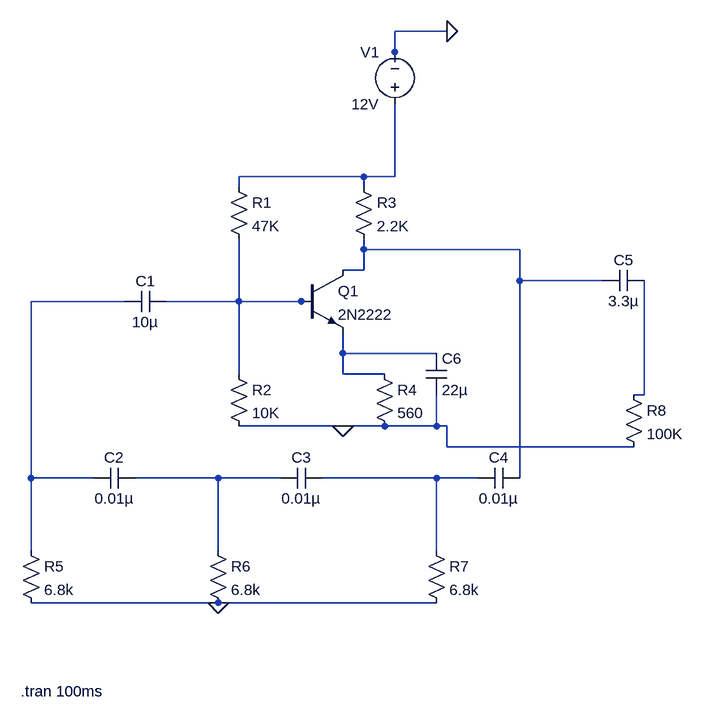
[diagram p0: schematic RC oscillator.asc]
RC oscillator.asc, the LTspice schematic file:
Version 4
SHEET 1 880 760
WIRE 352 -272 272 -272
WIRE 272 -240 272 -272
WIRE 272 -224 272 -240
WIRE 224 -48 32 -48
WIRE 272 -48 272 -160
WIRE 272 -48 224 -48
WIRE 32 -32 32 -48
WIRE 224 -32 224 -48
WIRE 224 64 224 48
WIRE 464 64 224 64
WIRE 224 96 224 64
WIRE 224 96 192 96
WIRE 464 112 464 64
WIRE 592 112 464 112
WIRE -144 144 -288 144
WIRE 32 144 32 48
WIRE 32 144 -80 144
WIRE 128 144 32 144
WIRE 144 144 128 144
WIRE 192 224 192 192
WIRE 336 224 192 224
WIRE 32 256 32 144
WIRE 192 256 192 224
WIRE 256 256 192 256
WIRE 656 288 656 112
WIRE 656 288 640 288
WIRE 192 336 32 336
WIRE 256 336 192 336
WIRE 336 336 336 288
WIRE 336 336 256 336
WIRE 352 336 336 336
WIRE 352 368 352 336
WIRE 640 368 352 368
WIRE -288 416 -288 144
WIRE -192 416 -288 416
WIRE 0 416 -128 416
WIRE 96 416 0 416
WIRE 336 416 160 416
WIRE 400 416 336 416
WIRE 464 416 464 112
WIRE -288 528 -288 416
WIRE 0 528 0 416
WIRE 336 528 336 416
WIRE 0 608 -288 608
WIRE 336 608 0 608
FLAG 352 -272 0
FLAG 192 336 0
FLAG 0 608 0
SYMBOL npn 128 96 R0
SYMATTR InstName Q1
SYMATTR Value 2N2222
SYMBOL res 16 -48 R0
SYMATTR InstName R1
SYMATTR Value 47K
SYMBOL res 208 -48 R0
SYMATTR InstName R3
SYMATTR Value 2.2K
SYMBOL res 16 240 R0
SYMATTR InstName R2
SYMATTR Value 10K
SYMBOL res 240 240 R0
SYMATTR InstName R4
SYMATTR Value 560
SYMBOL cap -128 400 R90
WINDOW 0 0 32 VBottom 2
WINDOW 3 32 32 VTop 2
SYMATTR InstName C2
SYMATTR Value 0.01µ
SYMBOL cap 160 400 R90
WINDOW 0 0 32 VBottom 2
WINDOW 3 32 32 VTop 2
SYMATTR InstName C3
SYMATTR Value 0.01µ
SYMBOL cap 464 400 R90
WINDOW 0 0 32 VBottom 2
WINDOW 3 32 32 VTop 2
SYMATTR InstName C4
SYMATTR Value 0.01µ
SYMBOL res -304 512 R0
SYMATTR InstName R5
SYMATTR Value 6.8k
SYMBOL res -16 512 R0
SYMATTR InstName R6
SYMATTR Value 6.8k
SYMBOL res 320 512 R0
SYMATTR InstName R7
SYMATTR Value 6.8k
SYMBOL cap 656 96 R90
WINDOW 0 0 32 VBottom 2
WINDOW 3 32 32 VTop 2
SYMATTR InstName C5
SYMATTR Value 3.3µ
SYMBOL res 624 272 R0
SYMATTR InstName R8
SYMATTR Value 100K
SYMBOL cap -80 128 R90
WINDOW 0 0 32 VBottom 2
WINDOW 3 32 32 VTop 2
SYMATTR InstName C1
SYMATTR Value 10µ
SYMBOL cap 320 224 R0
SYMATTR InstName C6
SYMATTR Value 22µ
SYMBOL voltage 272 -144 R180
WINDOW 0 24 96 Left 2
WINDOW 3 24 16 Left 2
WINDOW 123 0 0 Left 0
WINDOW 39 24 68 Left 2
SYMATTR InstName V1
SYMATTR Value 12V
TEXT -304 744 Left 2 !.tran 100ms

The netlist it stands for:
* RC oscillator.asc
Q1 N002 N004 N005 0 2N2222
R1 N001 N004 47K
R3 N001 N002 2.2K
R2 N004 0 10K
R4 N005 0 560
C2 N007 N003 0.01µ
C3 N008 N007 0.01µ
C4 N002 N008 0.01µ
R5 N003 0 6.8k
R6 N007 0 6.8k
R7 N008 0 6.8k
C5 N006 N002 3.3µ
R8 N006 0 100K
C1 N004 N003 10µ
C6 N005 0 22µ
V1 N001 0 12V
.model NPN NPN
.model PNP PNP
.lib standard.bjt
.tran 100ms
.backanno
.end